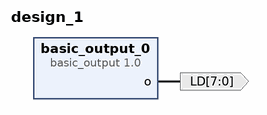
[diagram p0: block diagram of the top level]
# Vivado block design design_1, xc7z020clg484-1, Vivado 2019.2
create_bd_design design_1

create_bd_port -dir O -from 7 -to 0 -type data LD

create_bd_cell -type ip -vlnv xilinx.com:hls:basic_output:1.0 basic_output_0

# ---- connections ----

connect_bd_net [get_bd_pins basic_output_0/o] [get_bd_ports LD]

validate_bd_design
save_bd_design
